# Altium schematic sheet 03-FPGA_DECOUPLING.SchDoc: FPGA Decoupling
size A3; DrawnBy: Rain Adelbert; Revision: 1.2; SheetNumber: 3; SheetTotal: 9
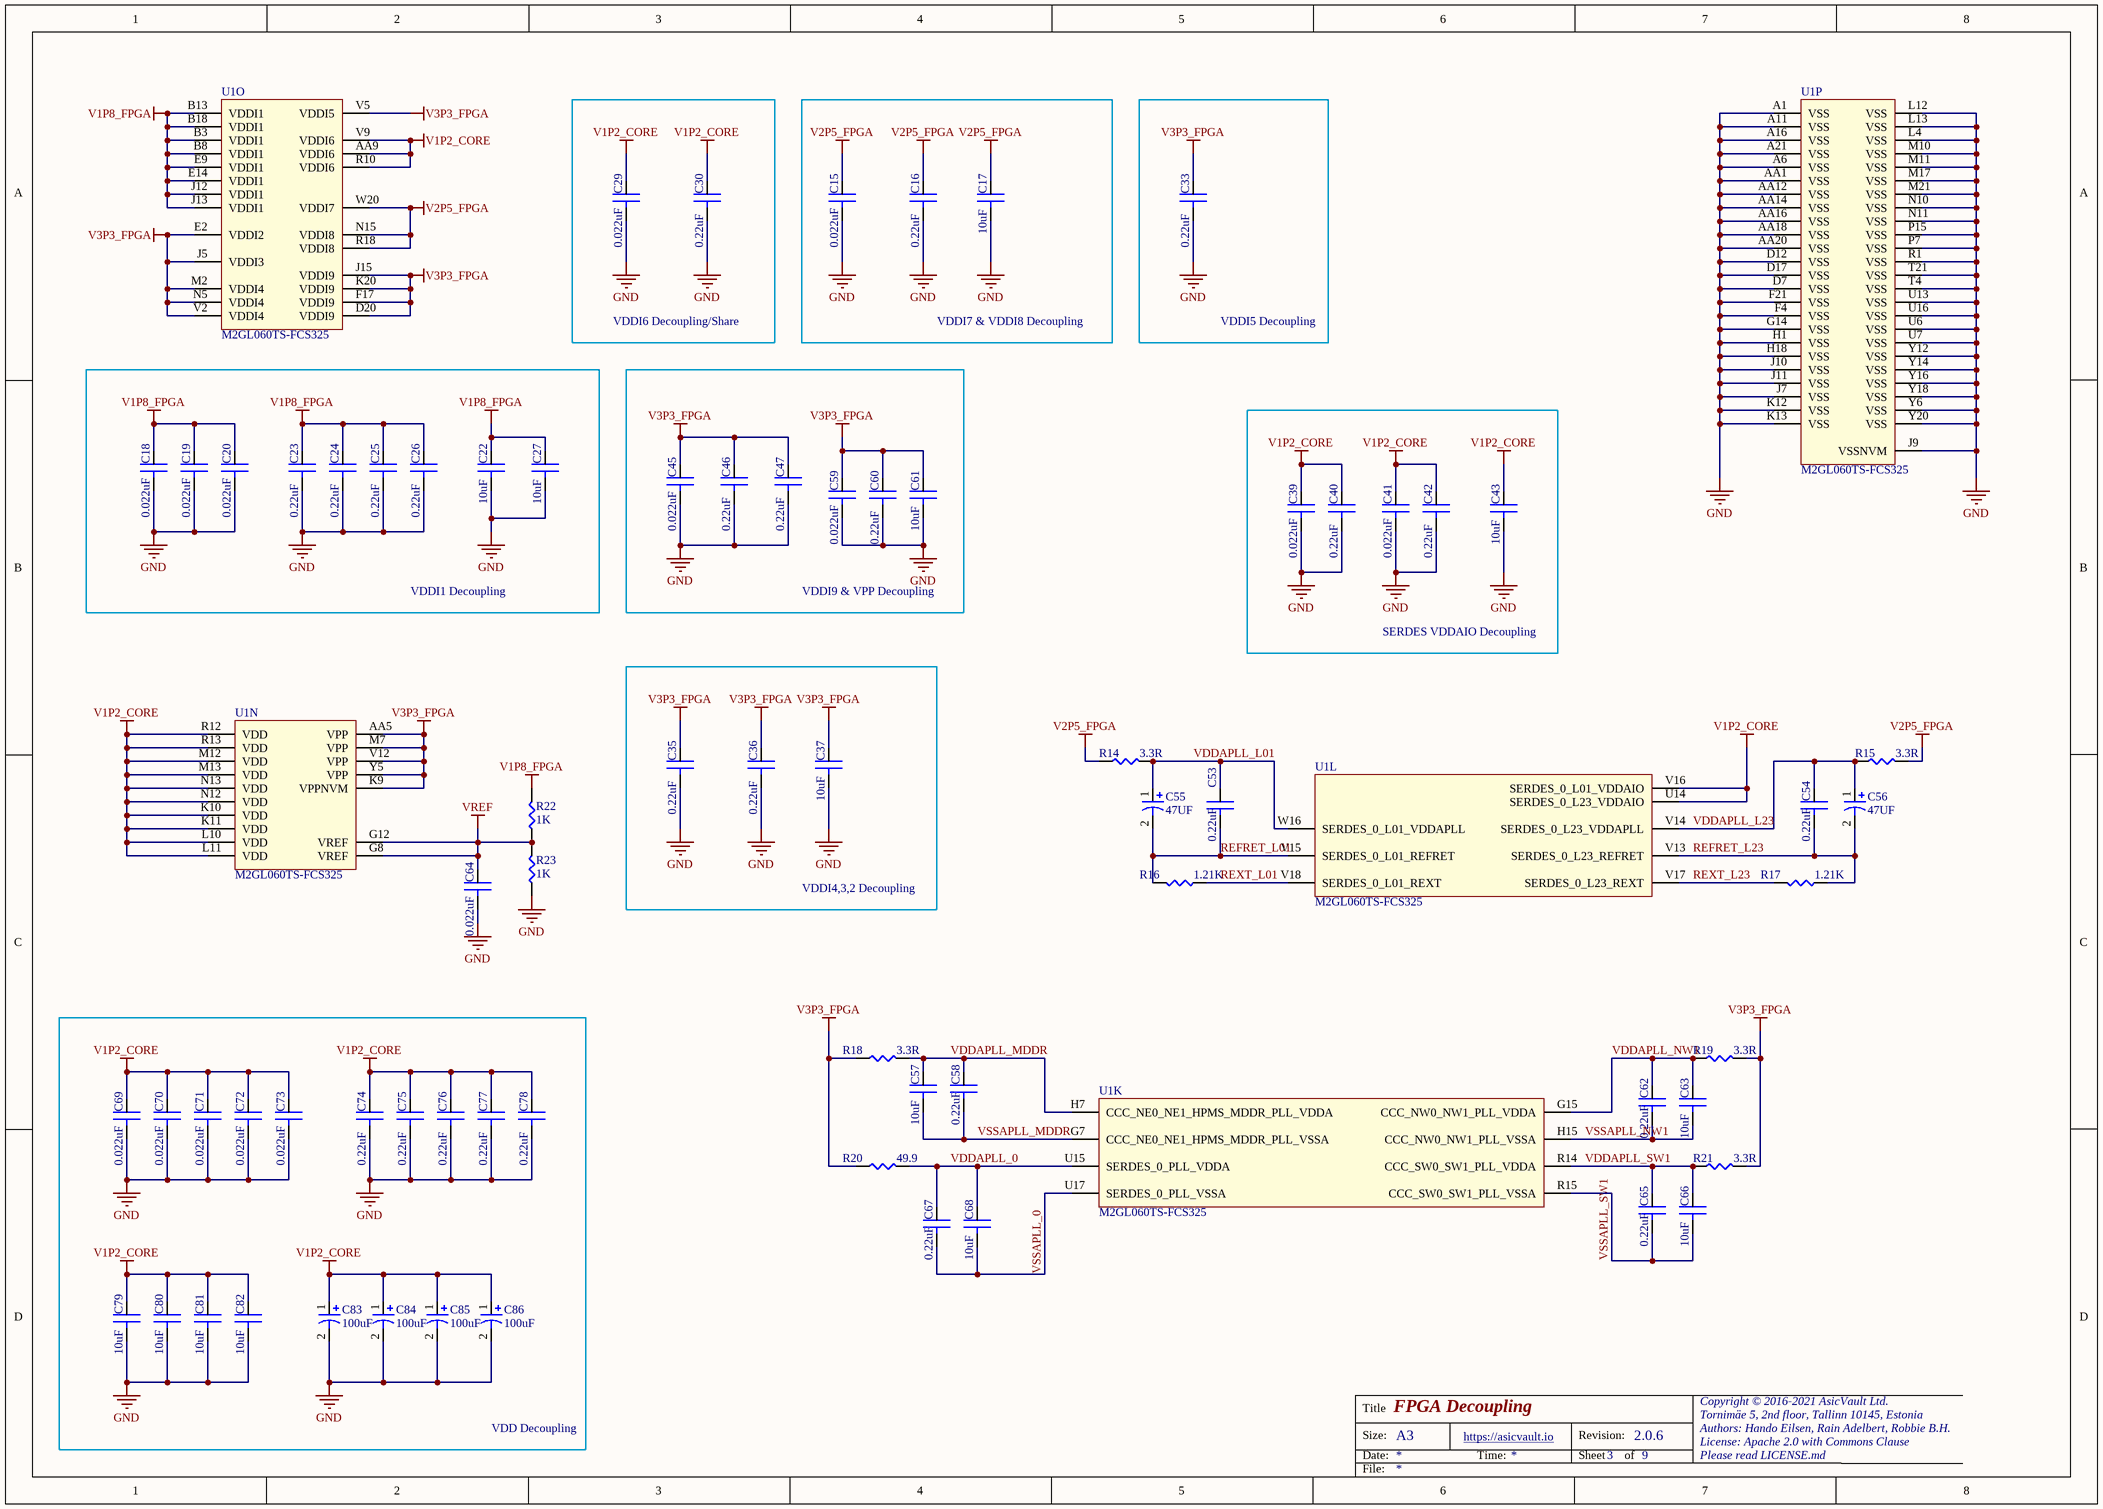
[diagram p0: 03-FPGA_DECOUPLING.SchDoc]

## Parts
C15  0.022uF  [C0201]
C16  0.22uF  [C0201]
C17  10uF  [C0402]
C18  0.022uF  [C0201]
C19  0.022uF  [C0201]
C20  0.022uF  [C0201]
C22  10uF  [C0402]
C23  0.22uF  [C0201]
C24  0.22uF  [C0201]
C25  0.22uF  [C0201]
C26  0.22uF  [C0201]
C27  10uF  [C0402]
C29  0.022uF  [C0201]
C30  0.22uF  [C0201]
C33  0.22uF  [C0201]
C35  0.22uF  [C0201]
C36  0.22uF  [C0201]
C37  10uF  [C0402]
C39  0.022uF  [C0201]
C40  0.22uF  [C0201]
C41  0.022uF  [C0201]
C42  0.22uF  [C0201]
C43  10uF  [C0402]
C45  0.022uF  [C0201]
C46  0.22uF  [C0201]
C47  0.22uF  [C0201]
C53  0.22uF  [C0201]
C54  0.22uF  [C0201]
C55  47UF  [M0603C]
C56  47UF  [M0603C]
C57  10uF  [C0402]
C58  0.22uF  [C0201]
C59  0.022uF  [C0201]
C60  0.22uF  [C0201]
C61  10uF  [C0402]
C62  0.22uF  [C0201]
C63  10uF  [C0402]
C64  0.022uF  [C0201]
C65  0.22uF  [C0201]
C66  10uF  [C0402]
C67  0.22uF  [C0201]
C68  10uF  [C0402]
C69  0.022uF  [C0201]
C70  0.022uF  [C0201]
C71  0.022uF  [C0201]
C72  0.022uF  [C0201]
C73  0.022uF  [C0201]
C74  0.22uF  [C0201]
C75  0.22uF  [C0201]
C76  0.22uF  [C0201]
C77  0.22uF  [C0201]
C78  0.22uF  [C0201]
C79  10uF  [C0402]
C80  10uF  [C0402]
C81  10uF  [C0402]
C82  10uF  [C0402]
C83  100uF  [C0805T]
C84  100uF  [C0805T]
C85  100uF  [C0805T]
C86  100uF  [C0805T]
R14  3.3R  [R0201]
R15  3.3R  [R0201]
R16  1.21K  [R0201]
R17  1.21K  [R0201]
R18  3.3R  [R0201]
R19  3.3R  [R0201]
R20  49.9  [R0201]
R21  3.3R  [R0201]
R22  1K  [R0201]
R23  1K  [R0201]
U1  M2GL060TS-FCS325  [FCS325-OPT1]  (parts K,L,N,O,P of 16)

## Blocks framed on the sheet
VDDI6 Decoupling/Share: C29 C30
VDDI7 & VDDI8 Decoupling: C15-C17
VDDI5 Decoupling: C33
VDDI1 Decoupling: C18-C20 C22-C27
VDDI9 & VPP Decoupling: C45-C47 C59-C61
SERDES VDDAIO Decoupling: C39-C43
VDDI4,3,2 Decoupling: C35-C37
VDD Decoupling: C69-C86

## Nets
GND: C15.2 C16.2 C17.2 C18.2 C19.2 C20.2 C22.2 C23.2 C24.2 C25.2 C26.2 C27.2 C29.2 C30.2 C33.2 C35.2 C36.2 C37.2 C39.2 C40.2 C41.2 C42.2 C43.2 C45.2 C46.2 C47.2 C59.2 C60.2 C61.2 C64.2 C69.2 C70.2 C71.2 C72.2 C73.2 C74.2 C75.2 C76.2 C77.2 C78.2 C79.2 C80.2 C81.2 C82.2 C83.2 C84.2 C85.2 C86.2 R23.1 U1.A1(VSS) U1.A6(VSS) U1.A11(VSS) U1.A16(VSS) U1.A21(VSS) U1.AA1(VSS) U1.AA12(VSS) U1.AA14(VSS) U1.AA16(VSS) U1.AA18(VSS) U1.AA20(VSS) U1.D7(VSS) U1.D12(VSS) U1.D17(VSS) U1.F4(VSS) U1.F21(VSS) U1.G14(VSS) U1.H1(VSS) U1.H18(VSS) U1.J7(VSS) U1.J9(VSSNVM) U1.J10(VSS) U1.J11(VSS) U1.K12(VSS) U1.K13(VSS) U1.L4(VSS) U1.L12(VSS) U1.L13(VSS) U1.M10(VSS) U1.M11(VSS) U1.M17(VSS) U1.M21(VSS) U1.N10(VSS) U1.N11(VSS) U1.P7(VSS) U1.P15(VSS) U1.R1(VSS) U1.T4(VSS) U1.T21(VSS) U1.U6(VSS) U1.U7(VSS) U1.U13(VSS) U1.U16(VSS) U1.Y6(VSS) U1.Y12(VSS) U1.Y14(VSS) U1.Y16(VSS) U1.Y18(VSS) U1.Y20(VSS)
V1P2_CORE: C29.1 C30.1 C39.1 C40.1 C41.1 C42.1 C43.1 C69.1 C70.1 C71.1 C72.1 C73.1 C74.1 C75.1 C76.1 C77.1 C78.1 C79.1 C80.1 C81.1 C82.1 C83.1 C84.1 C85.1 C86.1 U1.AA9(VDDI6) U1.K10(VDD) U1.K11(VDD) U1.L10(VDD) U1.L11(VDD) U1.M12(VDD) U1.M13(VDD) U1.N12(VDD) U1.N13(VDD) U1.R10(VDDI6) U1.R12(VDD) U1.R13(VDD) U1.U14(SERDES_0_L23_VDDAIO) U1.V9(VDDI6) U1.V16(SERDES_0_L01_VDDAIO)
V1P8_FPGA: C18.1 C19.1 C20.1 C22.1 C23.1 C24.1 C25.1 C26.1 C27.1 R22.2 U1.B3(VDDI1) U1.B8(VDDI1) U1.B13(VDDI1) U1.B18(VDDI1) U1.E9(VDDI1) U1.E14(VDDI1) U1.J12(VDDI1) U1.J13(VDDI1)
V2P5_FPGA: C15.1 C16.1 C17.1 R14.1 R15.2 U1.N15(VDDI8) U1.R18(VDDI8) U1.W20(VDDI7)
V3P3_FPGA: C33.1 C35.1 C36.1 C37.1 C45.1 C46.1 C47.1 C59.1 C60.1 C61.1 R18.1 R19.2 R20.1 R21.2 U1.AA5(VPP) U1.D20(VDDI9) U1.E2(VDDI2) U1.F17(VDDI9) U1.J5(VDDI3) U1.J15(VDDI9) U1.K9(VPPNVM) U1.K20(VDDI9) U1.M2(VDDI4) U1.M7(VPP) U1.N5(VDDI4) U1.V2(VDDI4) U1.V5(VDDI5) U1.V12(VPP) U1.Y5(VPP)
VREF: C64.1 R22.1 R23.2 U1.G8(VREF) U1.G12(VREF)
REFRET_L01: C53.2 C55.2 R16.2 U1.V15(SERDES_0_L01_REFRET)
REFRET_L23: C54.2 C56.2 R17.1 U1.V13(SERDES_0_L23_REFRET)
REXT_L01: R16.1 U1.V18(SERDES_0_L01_REXT)
REXT_L23: R17.2 U1.V17(SERDES_0_L23_REXT)
VDDAPLL_0: C67.1 C68.1 R20.2 U1.U15(SERDES_0_PLL_VDDA)
VDDAPLL_L01: C53.1 C55.1 R14.2 U1.W16(SERDES_0_L01_VDDAPLL)
VDDAPLL_L23: C54.1 C56.1 R15.1 U1.V14(SERDES_0_L23_VDDAPLL)
VDDAPLL_MDDR: C57.1 C58.1 R18.2 U1.H7(CCC_NE0_NE1_HPMS_MDDR_PLL_VDDA)
VDDAPLL_NW1: C62.1 C63.1 R19.1 U1.G15(CCC_NW0_NW1_PLL_VDDA)
VDDAPLL_SW1: C65.1 C66.1 R21.1 U1.R14(CCC_SW0_SW1_PLL_VDDA)
VSSAPLL_0: C67.2 C68.2 U1.U17(SERDES_0_PLL_VSSA)
VSSAPLL_MDDR: C57.2 C58.2 U1.G7(CCC_NE0_NE1_HPMS_MDDR_PLL_VSSA)
VSSAPLL_NW1: C62.2 C63.2 U1.H15(CCC_NW0_NW1_PLL_VSSA)
VSSAPLL_SW1: C65.2 C66.2 U1.R15(CCC_SW0_SW1_PLL_VSSA)

## Notes on the sheet
- Title
- Size:
- Date:
- A3
- https://asicvault.io
- Time:
- Revision:
- Sheet
- of
- 2.0.6
- Copyright © 2016-2021 AsicVault Ltd.
- Tornimäe 5, 2nd floor, Tallinn 10145, Estonia
- Authors: Hando Eilsen, Rain Adelbert, Robbie B.H.
- License: Apache 2.0 with Commons Clause
- Please read LICENSE.md
- File:

## Library data of the parts
C15 C18-C20 C29 C39 C41 C45 C59 C64 C69-C73 = 0.022uF/0201: Description 1: CAP CER 0.022UF 10V X7S 0201; Supplier 1: Digi-Key; Supplier Part Number 1: 445-13740-1-ND
C16 C23-C26 C30 C33 C35 C36 C40 C42 C46 C47 C53 C54 C58 C60 C62 C65 C67 C74-C78 = 0.22uF/0201: Description 1: CAP CER 0.22UF 6.3V X7S 0201; Supplier 1: Digi-Key; Supplier Part Number 1: 445-9075-1-ND
C17 C22 C27 C37 C43 C57 C61 C63 C66 C68 C79-C82 = 10uF/0402: Description 1: Multilayer Ceramic Capacitors MLCC - SMD/SMT 10uF 20% 6.3 Volts 0402; Supplier Part Number 1: 791-0402X106M6R3CT; Supplier 1: Mouser
C55 C56 = 47UF/4V: Description 1: CAP TANT 47UF 4V 20% 0603; Supplier 1: Digi-Key; Supplier Part Number 1: 478-8635-1-ND
C83-C86 = 100uF/0805: Description 1: CAP TANT POLY 100UF 2.5V 0805; Supplier 1: Digi-Key; Supplier Part Number 1: ETPU100MSI-ND
R14 R15 R18 R19 R21 = 3.3R/1%/0201: Description 1: RES SMD 3.3 OHM 1% 1/20W 0201; Supplier 1: Digi-Key; Supplier Part Number 1: AC0201FR-073R3L-ND
R16 R17 = 1.21K/1%/0201: Description 1: RES SMD 1.21K OHM 1% 1/20W 0201; Supplier 1: Digi-Key; Supplier Part Number 1: YAG2475CT-ND
R20 = 49.9/1%/0201: Description 1: RES SMD 49.9 OHM 1% 1/20W 0201; Supplier 1: Digi-Key; Supplier Part Number 1: YAG2702CT-ND
R22 R23 = 1K/1%/0201: Description 1: RES SMD 1K OHM 1% 1/20W 0201; Supplier 1: Digi-Key; Supplier Part Number 1: 311-1KMCT-ND
U1 = M2GL060TS-FCS325: Description 1: IC FPGA 200 I/O 325FCBGA; Supplier 1: Digi-Key; Supplier Part Number 1: M2GL060TS-FCS325-ND